# EAGLE design psvsd-v10 (EAGLE 8.2.2)

## Sheet 1 of 2: SD/USB
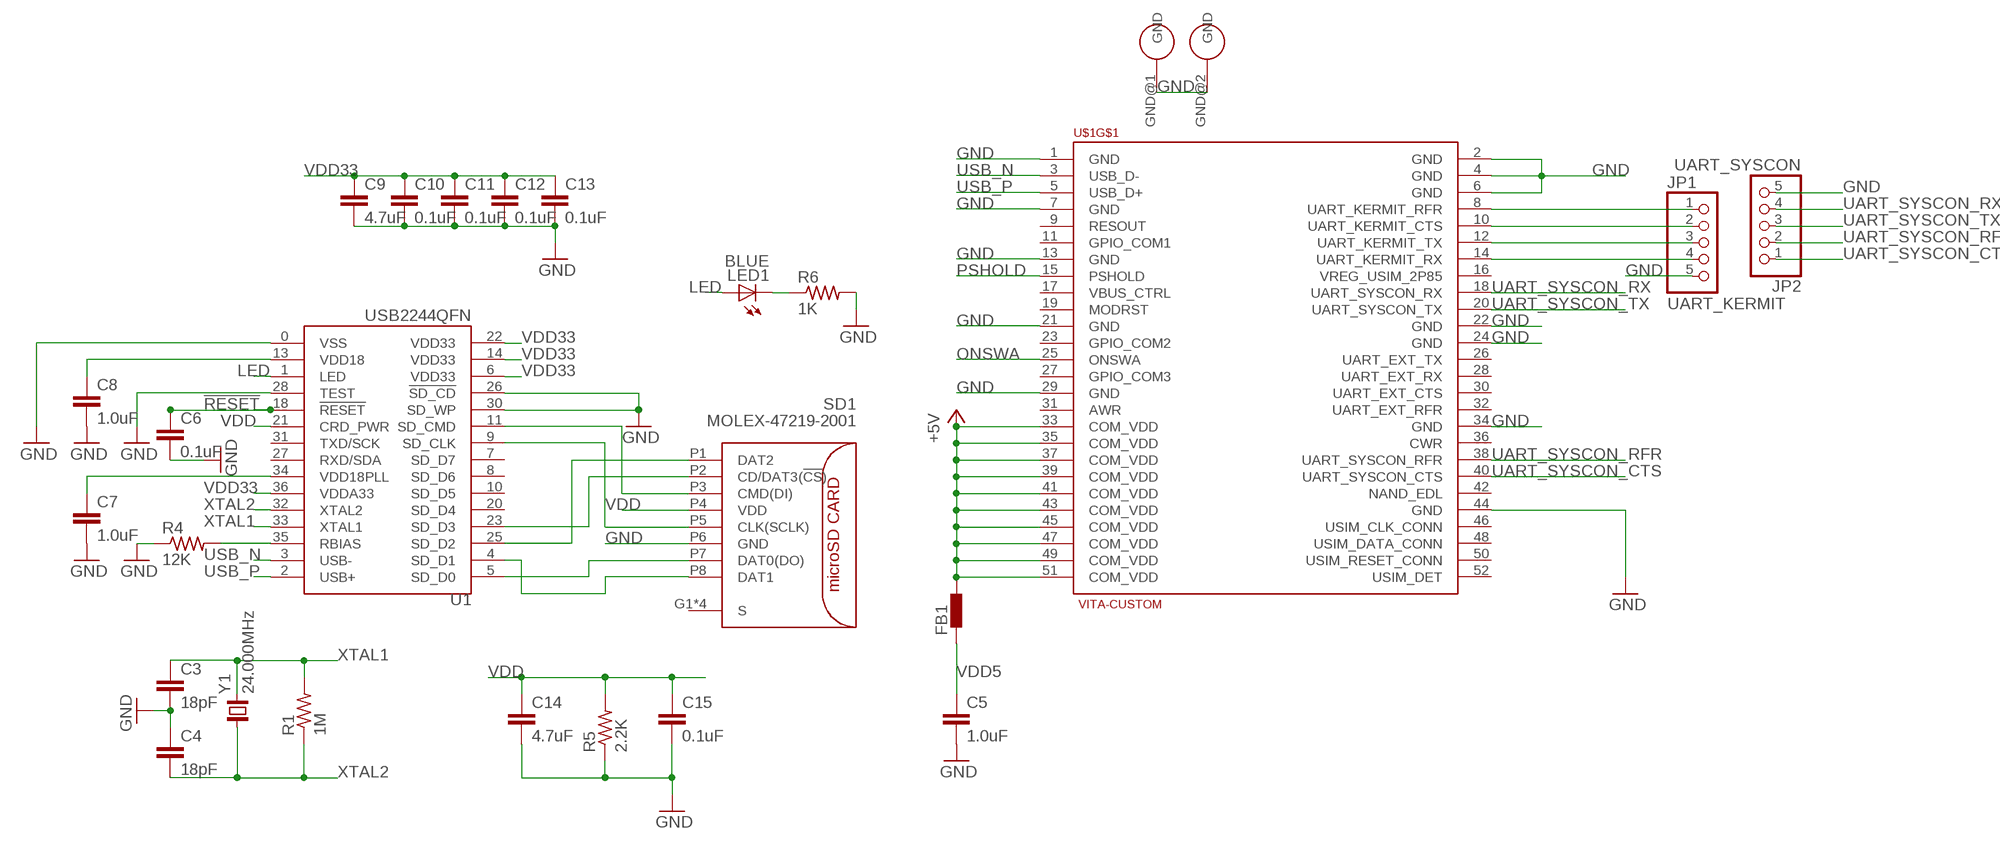
[diagram p0: schematic, sheet 1]

### Parts
C3  18pF  C-EUC0402  [C0402]
C4  18pF  C-EUC0402  [C0402]
C5  1.0uF  C-EUC0603  [C0603]
C6  0.1uF  C-EUC0402  [C0402]
C7  1.0uF  C-EUC0603  [C0603]
C8  1.0uF  C-EUC0603  [C0603]
C9  4.7uF  C-EUC0603  [C0603]
C10  0.1uF  C-EUC0402  [C0402]
C11  0.1uF  C-EUC0402  [C0402]
C12  0.1uF  C-EUC0402  [C0402]
C13  0.1uF  C-EUC0402  [C0402]
C14  4.7uF  C-EUC0603  [C0603]
C15  0.1uF  C-EUC0402  [C0402]
FB1  BLM15HB121SN1  [0402]
JP1  UART_KERMIT  PINHD-1X5  [1X05]
JP2  UART_SYSCON  PINHD-1X5  [1X05]
LED1  BLUE  LEDSML0603  [SML0603]
R1  1M  R-US_R0603  [R0603]
R4  12K  R-US_R0603  [R0603]
R5  2.2K  R-US_R0603  [R0603]
R6  1K  R-US_R0603  [R0603]
SD1  MOLEX-47219-2001  [MOLEX:47219-2001]
U1  USB2244QFN  [QFN36]
U$1  VITA-CUSTOM  [VITA-MINI-PCI-E]
Y1  24.000MHz  XRCGB  [XRCGB]

### Nets
!RESET: C6.1 U1.18(!RESET) ; also sheet 2
+5V: FB1.2 U$1.33(COM_VDD) U$1.35(COM_VDD) U$1.37(COM_VDD) U$1.39(COM_VDD) U$1.41(COM_VDD) U$1.43(COM_VDD) U$1.45(COM_VDD) U$1.47(COM_VDD) U$1.49(COM_VDD) U$1.51(COM_VDD)
GND: C3.2 C4.1 C5.2 C6.2 C7.2 C8.2 C9.2 C10.2 C11.2 C12.2 C13.2 C14.2 C15.2 JP1.5 JP2.5 R4.1 R5.1 R6.2 SD1.P6(GND) U1.0(VSS) U1.26(!SD_CD) U1.28(TEST) U1.30(SD_WP) U$1.1(GND) U$1.2(GND) U$1.4(GND) U$1.6(GND) U$1.7(GND) U$1.13(GND) U$1.21(GND) U$1.22(GND) U$1.24(GND) U$1.29(GND) U$1.34(GND) U$1.44(GND) U$1.GND@1(GND) U$1.GND@2(GND) ; also sheet 2
LED: LED1.A U1.1(LED)
N$1: LED1.C R6.1
ONSWA: U$1.25(ONSWA) ; also sheet 2
PSHOLD: U$1.15(PSHOLD) ; also sheet 2
RBIAS: R4.2 U1.35(RBIAS)
SD_CLK: SD1.P5(CLK(SCLK)) U1.9(SD_CLK)
SD_CMD: SD1.P3(CMD(DI)) U1.11(SD_CMD)
SD_D0: SD1.P7(DAT0(DO)) U1.5(SD_D0)
SD_D1: SD1.P8(DAT1) U1.4(SD_D1)
SD_D2: SD1.P1(DAT2) U1.25(SD_D2)
SD_D3: SD1.P2(CD/DAT3(!CS!)) U1.23(SD_D3)
UART_KERMIT_CTS: JP1.2 U$1.10(UART_KERMIT_CTS)
UART_KERMIT_RFR: JP1.1 U$1.8(UART_KERMIT_RFR)
UART_KERMIT_RX: JP1.4 U$1.14(UART_KERMIT_RX)
UART_KERMIT_TX: JP1.3 U$1.12(UART_KERMIT_TX)
UART_SYSCON_CTS: JP2.1 U$1.40(UART_SYSCON_CTS)
UART_SYSCON_RFR: JP2.2 U$1.38(UART_SYSCON_RFR)
UART_SYSCON_RX: JP2.4 U$1.18(UART_SYSCON_RX)
UART_SYSCON_TX: JP2.3 U$1.20(UART_SYSCON_TX)
USB_N: U1.3(USB-) U$1.3(USB_D-)
USB_P: U1.2(USB+) U$1.5(USB_D+)
USBVDD18: C8.1 U1.13(VDD18)
USBVDD18PLL: C7.1 U1.34(VDD18PLL)
VDD: C14.1 C15.1 R5.2 SD1.P4(VDD) U1.21(CRD_PWR)
VDD5: C5.1 FB1.1 ; also sheet 2
VDD33: C9.1 C10.1 C11.1 C12.1 C13.1 U1.6(VDD33) U1.14(VDD33) U1.22(VDD33) U1.36(VDDA33) ; also sheet 2
XTAL1: C3.1 R1.2 U1.33(XTAL1) Y1.3
XTAL2: C4.2 R1.1 U1.32(XTAL2) Y1.1
Unconnected: SD1.G1(S) SD1.G2(S) SD1.G3(S) SD1.G4(S) U1.7(SD_D7) U1.8(SD_D6) U1.10(SD_D5) U1.20(SD_D4) U1.27(RXD/SDA) U1.31(TXD/SCK) U$1.9(RESOUT) U$1.11(GPIO_COM1) U$1.16(VREG_USIM_2P85) U$1.17(VBUS_CTRL) U$1.19(MODRST) U$1.23(GPIO_COM2) U$1.26(UART_EXT_TX) U$1.27(GPIO_COM3) U$1.28(UART_EXT_RX) U$1.30(UART_EXT_CTS) U$1.31(AWR) U$1.32(UART_EXT_RFR) U$1.36(CWR) U$1.42(NAND_EDL) U$1.46(USIM_CLK_CONN) U$1.48(USIM_DATA_CONN) U$1.50(USIM_RESET_CONN) U$1.52(USIM_DET)

## Sheet 2 of 2: Power Management
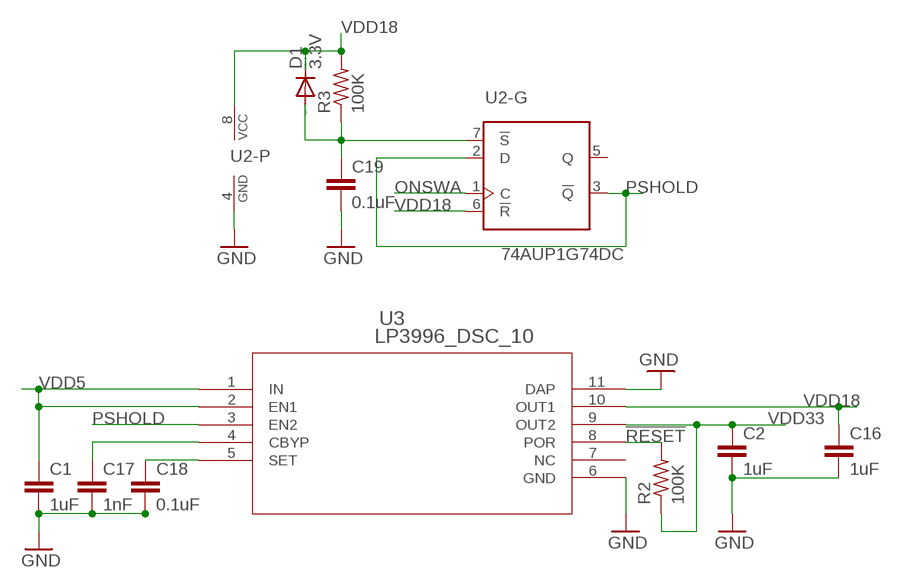
[diagram p1: schematic, sheet 2]

### Parts
C1  1uF  C-EUC0603  [C0603]
C2  1uF  C-EUC0603  [C0603]
C16  1uF  C-EUC0603  [C0603]
C17  1nF  C-EUC0402  [C0402]
C18  0.1uF  C-EUC0402  [C0402]
C19  0.1uF  C-EUC0402  [C0402]
D1  3.3V  DIODE-SOD523  [SOD523]
R2  100K  R-US_R0603  [R0603]
R3  100K  R-US_R0603  [R0603]
U2  74AUP1G74DC  [SOT765]
U3  LP3996_DSC_10  [SDA10A]

### Nets
!RESET: R2.2 U3.8(POR) ; also sheet 1
!S: C19.1 D1.A R3.1 U2.7(-G:!S)
CBYP: C17.1 U3.4(CBYP)
CSET: C18.1 U3.5(SET)
GND: C1.2 C2.2 C16.2 C17.2 C18.2 C19.2 U2.4(-P:GND) U3.6(GND) U3.11(DAP) ; also sheet 1
ONSWA: U2.1(-G:C) ; also sheet 1
PSHOLD: U2.2(-G:D) U2.3(-G:!Q) U3.3(EN2) ; also sheet 1
VDD5: C1.1 U3.1(IN) U3.2(EN1) ; also sheet 1
VDD18: C16.1 D1.C R3.2 U2.6(-G:!R) U2.8(-P:VCC) U3.10(OUT1)
VDD33: C2.1 R2.1 U3.9(OUT2) ; also sheet 1
Unconnected: U2.5(-G:Q) U3.7(NC)

## Library data of the parts
C1-C17 C19 = rcl:C-EU: CAPACITOR, European symbol
C18 = resistor:C-EU: CAPACITOR, European symbol
D1 = diode:DIODE-: DIODE
FB1 = inductors:BLM15H: EMIFIL (R) Chip Ferrite Bead for GHz Noise Source: http://www.murata.com/ Ferrite Bead BLM15H.pdf
JP1 JP2 = pinhead:PINHD-1X5: PIN HEADER
LED1 = led:LED: LED OSRAM: - CHIPLED LG R971, LG N971, LY N971, LG Q971, LY Q971, LO R971, LY R971 LH N974, LH R974 LS Q976, LO Q976, LY Q976 LO Q996 - Hyper CHIPLED LW Q18S LB Q993, LB Q99A, LB R99A - SideLED LS A670, LO A670, LY A670, LG A670, LP A670 LB A673, LV A673, LT A673, LW A673 LH A674 LY A675 LS A676, LA A676, LO A676, LY A676, LW A676 LS A679, LY A679, LG A679 - Hyper Micro SIDELED® LS Y876, LA Y876, LO Y876, LY Y876 LT Y87S - SmartLED LW L88C, LW L88S LB L89C, LB L89S, LG L890 LS L89K, LO L89K, LY L89K LS L896, LA L896, LO L896, LY L896 - TOPLED LS T670, LO T670, LY T670, LG T670, LP T670 LSG T670, LSP T670, LSY T670, LOP T670, LYG T670 LG T671, LOG T671, LSG T671 LB T673, LV T673, LT T673, LW T673 LH T674 LS T676, LA T676, LO T676, LY T676, LB T676, LH T676, LSB T676, LW T676 LB T67C, LV T67C, LT T67C, LS T67K, LO T67K, LY T67K, LW E67C LS E67B, LA E67B, LO E67B, LY E67B, LB E67C, LV E67C, LT E67C LW T67C LS T679, LY T679, LG T679 LS T770, LO T770, LY T770, LG T770, LP T770 LB T773, LV T773, LT T773, LW T773 LH T774 LS E675, LA E675, LY E675, LS T675 LS T776, LA T776, LO T776, LY T776, LB T776 LHGB T686 LT T68C, LB T68C - Hyper Mini TOPLED® LB M676 - Mini TOPLED Santana® LG M470 LS M47K, LO M47K, LY M47K Source: http://www.osram.convergy.de LUXEON: - LUMILED® LXK2-PW12-R00, LXK2-PW12-S00, LXK2-PW14-U00, LXK2-PW14-V00 LXK2-PM12-R00, LXK2-PM12-S00, LXK2-PM14-U00 LXK2-PE12-Q00, LXK2-PE12-R00, LXK2-PE12-S00, LXK2-PE14-T00, LXK2-PE14-U00 LXK2-PB12-K00, LXK2-PB12-L00, LXK2-PB12-M00, LXK2-PB14-N00, LXK2-PB14-P00, LXK2-PB14-Q00 LXK2-PR12-L00, LXK2-PR12-M00, LXK2-PR14-Q00, LXK2-PR14-R00 LXK2-PD12-Q00, LXK2-PD12-R00, LXK2-PD12-S00 LXK2-PH12-R00, LXK2-PH12-S00 LXK2-PL12-P00, LXK2-PL12-Q00, LXK2-PL12-R00 Source: www.luxeon.com KINGBRIGHT: KA-3528ASYC Source: www.kingbright.com
R1-R6 = rcl:R-US_: RESISTOR, American symbol
SD1 = molex:MOLEX-47219-2001
U1 = USB2244:USB2244: USB2244/USB2244I
U2 = NXP_60_26022015:74AUP1G74: Low-power D-type flip-flop with set and reset; positive-edge trigger The 74AUP1G74 provides a low-power, low-voltage single positive-edge triggered D-type flip-flop with individual data (D), clock (CP), set (SD) and reset (RD) inputs and complementary Q and Q outputs. The SD and RD are asynchronous active LOW inputs and operate independently of the clock input. Information on the data input is transferred to the Q output on the LOW-to-HIGH transition of the clock pulse. The D input must be stable one set-up time prior to the LOW-to-HIGH clock transition for predictable operation. Schmitt trigger action at all inputs makes the circuit tolerant to slower input rise and fall times across the entire VCC range from 0.8 V to 3.6 V. This device ensures a very low static and dynamic power consumption across the entire VCC range from 0.8 V to 3.6 V. This device is fully specified for partial power-down applications using IOFF. The IOFF circuitry disables the output, preventing the damaging backflow current through the device when it is powered down. AAL Eindhoven MK
U3 = LP3996:LP3996_DSC_10; BASE_PN: LP3996; COMP: TypeLDO; LIBRARY: ReferenceLP3996SD; PARTNUMBER: LP3996SD0833; PIN: Count10; SYMBOL: NameLP3996SD0833; TYPE: LP3996SD0833; VENDOR: NationalSemiconductor; VERSION: 1
U$1 = mini-pci-e:VITA-CUSTOM: Vita specific half Mini PCI Express module.
Y1 = crystal:XRCGB: CRYSTAL

## Board
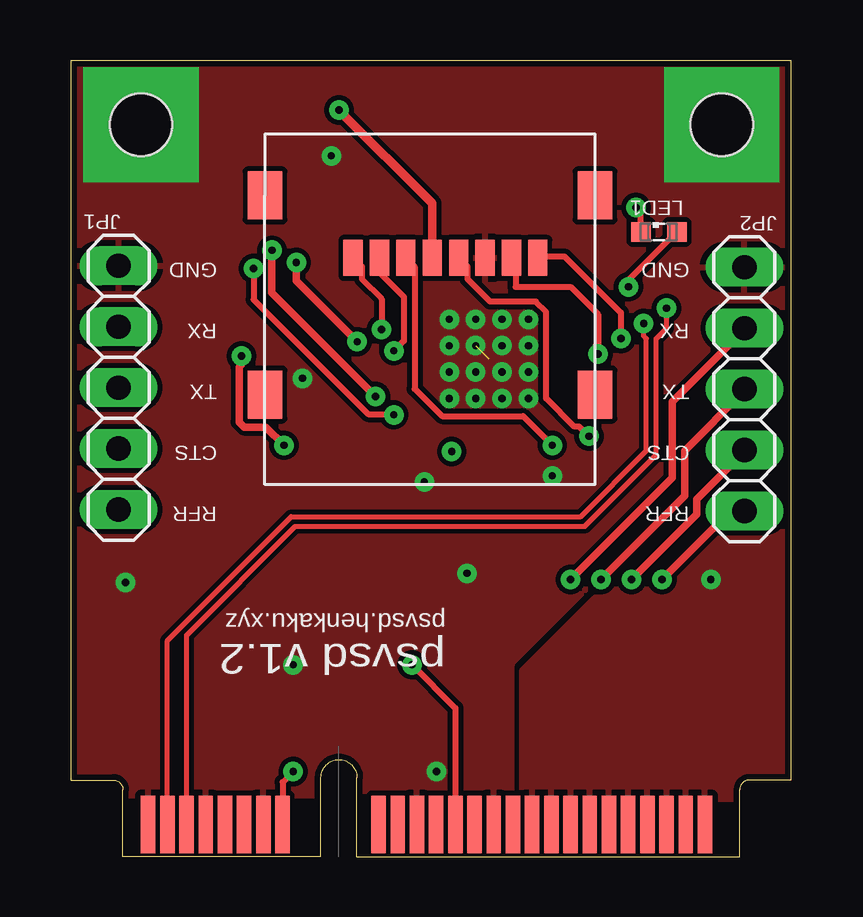
[diagram p2: board, top side]
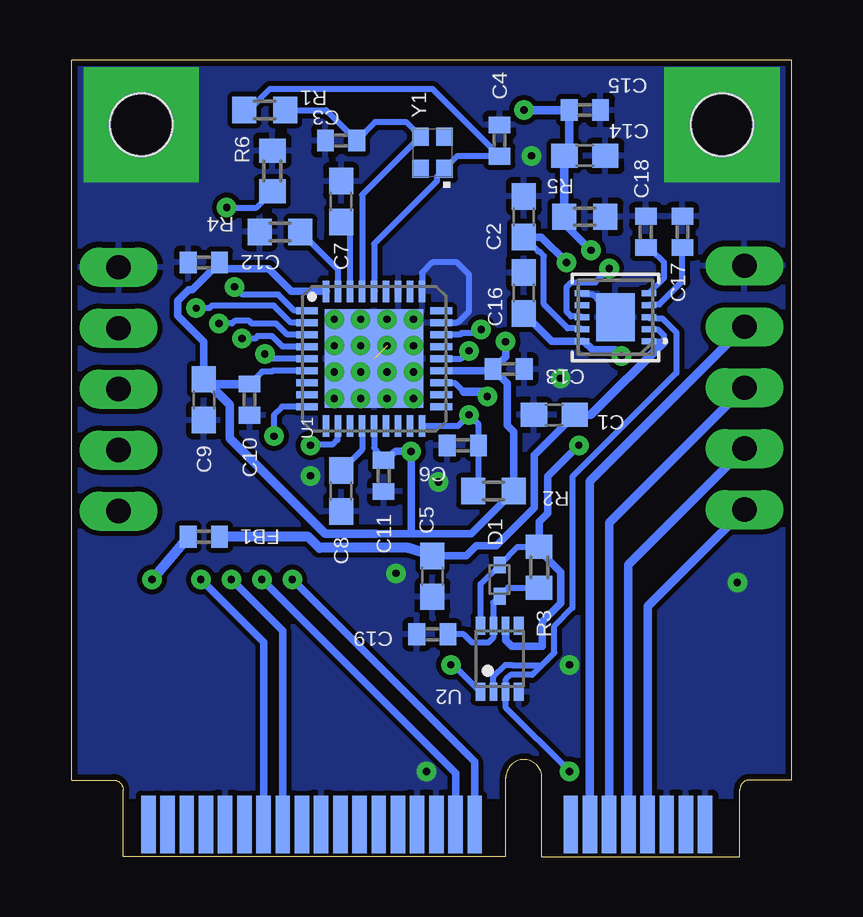
[diagram p3: board, bottom side, seen from below]

Size 30 x 33.2 mm. Coordinates in mm from the lower left corner, seen from the top.
Copper layers (1*16): Top 0.035mm / dielectric 1.5mm / Bottom 0.035mm
Design rules "SparkFun *": minimum track width 8mil, minimum drill 12mil, track to track 8mil, track to pad 8mil, pad to pad 8mil, via to via 8mil, smd to smd 8mil, copper to edge 10mil, drill to drill 8mil, minimum pad ring 12mil, minimum via ring 10mil, stop-mask expansion 4mil, vias tented up to drill 25mil, thermal gap 10mil

### Footprints (pad centres in the part's own frame; a part is rotated, then mirrored left to right if it is on the bottom)
C0603 = smd 1.1 x 1: 1 -0.85,0; 2 0.85,0
C0402 = smd 0.7 x 0.9: 1 -0.65,0; 2 0.65,0
SOD523 = smd 0.7 x 0.5: A 0.7,0; C -0.6,0
0402 = smd 0.7 x 0.9: 1 -0.65,0; 2 0.65,0
1X05 = drill 1.016 long: 1 -5.08,0; 2 -2.54,0; 3 0,0; 4 2.54,0; 5 5.08,0
SML0603 = smd 0.8 x 0.8: A 0.75,0; C -0.75,0
R0603 = smd 1 x 1.1: 1 -0.85,0; 2 0.85,0
MOLEX:47219-2001 = smd 1.45 x 2: G1 13.75,0; G2 13.75,8.3; G3 0,8.3; G4 0,0 | smd 0.8 x 1.5: P1 10.08,2.6; P2 8.98,2.6; P3 7.88,2.6; P4 6.78,2.6; P5 5.68,2.6; P6 4.58,2.6; P7 3.48,2.6; P8 2.38,2.6
QFN36 = smd 4.1 x 4.1: 0 0,0 | smd 0.28 x 0.9: 1 -2,-2.8; 2 -1.5,-2.8; 3 -1,-2.8; 4 -0.5,-2.8; 5 0,-2.8; 6 0.5,-2.8; 7 1,-2.8; 8 1.5,-2.8; 9 2,-2.8; 19 2,2.8; 20 1.5,2.8; 21 1,2.8; 22 0.5,2.8; 23 0,2.8; 24 -0.5,2.8; 25 -1,2.8; 26 -1.5,2.8; 27 -2,2.8 | smd 0.9 x 0.28: 10 2.8,-2; 11 2.8,-1.5; 12 2.8,-1; 13 2.8,-0.5; 14 2.8,0; 15 2.8,0.5; 16 2.8,1; 17 2.8,1.5; 18 2.8,2; 28 -2.8,2; 29 -2.8,1.5; 30 -2.8,1; 31 -2.8,0.5; 32 -2.8,0; 33 -2.8,-0.5; 34 -2.8,-1; 35 -2.8,-1.5; 36 -2.8,-2
SOT765 = smd 0.4 x 0.75: 1 -0.8,-1.375; 4 0.8,-1.375; 5 0.8,1.375; 8 -0.8,1.375 | smd 0.3 x 0.75: 2 -0.25,-1.375; 3 0.25,-1.375; 6 0.25,1.375; 7 -0.25,1.375
SDA10A = smd 0.61 x 0.254: 1 -1.397,1; 2 -1.397,0.5; 3 -1.397,0; 4 -1.397,-0.5; 5 -1.397,-1; 6 1.397,-1; 7 1.397,-0.5; 8 1.397,0; 9 1.397,0.5; 10 1.397,1 | smd 1.6 x 2.007: 11 0,0
VITA-MINI-PCI-E = smd 0.6 x 2.4: 1 -7.95,1.35; 3 -7.15,1.35; 5 -6.35,1.35; 7 -5.55,1.35; 9 -4.75,1.35; 11 -3.95,1.35; 13 -3.15,1.35; 15 -2.35,1.35; 17 1.65,1.35; 19 2.45,1.35; 21 3.25,1.35; 23 4.05,1.35; 25 4.85,1.35; 27 5.65,1.35; 29 6.45,1.35; 31 7.25,1.35; 33 8.05,1.35; 35 8.85,1.35; 37 9.65,1.35; 39 10.45,1.35; 41 11.25,1.35; 43 12.05,1.35; 45 12.85,1.35; 47 13.65,1.35; 49 14.45,1.35; 51 15.25,1.35 | smd 0.6 x 2.4 bottom: 2 -7.55,1.35; 4 -6.75,1.35; 6 -5.95,1.35; 8 -5.15,1.35; 10 -4.35,1.35; 12 -3.55,1.35; 14 -2.75,1.35; 16 -1.95,1.35; 18 2.05,1.35; 20 2.85,1.35; 22 3.65,1.35; 24 4.45,1.35; 26 5.25,1.35; 28 6.05,1.35; 30 6.85,1.35; 32 7.65,1.35; 34 8.45,1.35; 36 9.25,1.35; 38 10.05,1.35; 40 10.85,1.35; 42 11.65,1.35; 44 12.45,1.35; 46 13.25,1.35; 48 14.05,1.35; 50 14.85,1.35; 52 15.65,1.35 | drill 2.6 pad 4.8 square: GND@1 -8.25,30.5; GND@2 15.95,30.5 | hole 2.6: -8.25,30.5; 15.95,30.5
XRCGB = smd 0.75 x 0.7: 1 -0.675,-0.5; 2 0.675,-0.5; 3 0.675,0.5; 4 -0.675,0.5

### Placement (x,y rotation side)
C1  9.88,18.41 180 bottom
C2  11.15,26.67 90 bottom
C3  18.77,29.84 180 bottom
C4  12.17,29.84 270 bottom
C5  14.96,11.68 270 bottom
C6  13.69,17.14 180 bottom
C7  18.77,27.3 90 bottom
C8  18.77,15.24 270 bottom
C9  24.48,19.05 270 bottom
C10  22.58,19.05 270 bottom
C11  16.99,15.88 270 bottom
C12  24.48,24.77 180 bottom
C13  11.79,20.32 0 bottom
C14  8.61,29.21 0 bottom
C15  8.61,31.12 0 bottom
C16  11.15,23.49 90 bottom
C17  4.55,26.04 90 bottom
C18  6.07,26.04 90 bottom
C19  14.96,9.27 180 bottom
D1  12.17,11.56 270 bottom
FB1  24.48,13.34 180 bottom
JP1  1.97,19.54 90 top
JP2  28.04,19.48 90 top
LED1  24.48,26.04 0 top
R1  21.95,31.12 0 bottom
R2  12.42,15.24 180 bottom
R3  10.52,12.07 90 bottom
R4  21.31,26.04 0 bottom
R5  8.61,26.67 180 bottom
R6  21.63,28.57 90 bottom
SD1  21.82,27.56 180 top
U1  17.39,20.75 270 bottom
U2  12.17,8.26 0 bottom
U3  7.34,22.48 180 bottom
U$1  11.15,0 0 top
Y1  14.96,29.34 90 bottom

### Tracks (layer width: path | path; a pad name or v marks a point on that pad's centre or on a via)
!RESET  (via drill 0.3)
  Top 0.254: v13.44,18.41 13.41,18.44 12.37,18.44 7.59,23.21 v7.59,24.51
  Bottom 0.254: R2.2 13.04,15.24 C6.1 13.04,18.02 v13.44,18.41 13.9,17.95 U1.18 | U3.8 8.78,22.52 9.18,22.52 9.37,22.71 9.37,23.74 9.18,23.94 8.17,23.94 v7.59,24.51
!S
  Bottom 0.254: U2.7 12.44,9.61 12.44,9.48 | 12.44,9.48 12.44,9.12 12.63,8.93 13.3,8.93 13.65,9.27 C19.1 | 12.44,9.48 12.44,10.59 D1.A 11.81,11.21 R3.1
+5V  (via drill 0.3)
  Top 0.406: U$1.35 20.04,1.39 | 26.39,1.36 U$1.51
  Bottom 0.406: FB1.2 v26.64,11.56
  pour Top: 18.77,2.41 29.95,2.41 29.95,13.84 24.87,13.84 18.77,7.75
CBYP
  Bottom 0.254: U3.4 5.9,23.02 5.5,23.02 4.55,23.98 C17.1
CSET
  Bottom 0.254: C18.1 6.07,25.27 5.82,25.27 5.31,24.77 5.31,24.11 U3.5
GND  (via drill 0.3)  (1 unrouted)
  Top 0.254: 5.77,1.52 U$1.7
  Bottom 0.254: U3.6 8.69,23.44 8.3,23.44 8.1,23.24 U3.11 | U1.26 13.95,22.25 13.93,22.28 13.89,22.28 13.44,22.73 13.44,24.26 13.94,24.77 14.96,24.77 15.39,24.33 U1.28
  other vias: 10.83,29.21 2.26,11.43 15.75,22.39 16.85,22.39 17.95,22.39 19.05,22.39 15.75,21.29 16.85,21.29 17.95,21.29 19.05,21.29 15.75,20.2 16.85,20.2 17.95,20.2 19.05,20.2 15.75,19.09 16.85,19.09 17.95,19.09 19.05,19.09 9.25,8 14.71,15.62 9.63,19.94 20.04,15.88 16.48,11.81 15.21,3.56
  pour Top (rank 2): -0.28,33.66 30.2,33.66 30.2,2.54 -0.28,2.54
  pour Bottom (rank 2): -0.28,33.66 30.2,33.66 30.2,2.54 -0.28,2.54
LED  (via drill 0.3)
  Top 0.254: v23.22,23.75 23.22,24.02 LED1.A
  Bottom 0.254: U1.1 20.72,22.75 21.38,23.42 22.88,23.42 v23.22,23.75
N$1  (via drill 0.3)
  Top 0.254: LED1.C 23.73,26.85 v23.53,27.05
  Bottom 0.254: v23.53,27.05 22.3,27.05 R6.1
ONSWA  (via drill 0.3)
  Top 0.254: v14.2,8 16,6.2 U$1.25
  Bottom 0.254: U2.1 14.09,8 v14.2,8
PSHOLD  (via drill 0.3)
  Top 0.254: v9.25,3.56 8.8,3.11 U$1.15
  Bottom 0.254: U2.3 | U3.3 5.9,22.44 5.38,22.44 4.8,21.86 4.8,20.17 9.13,15.84 9.13,10.37 9.88,9.62 9.88,8.51 10.4,7.99 | 10.4,7.99 10.8,7.58 11.7,7.58 11.9,7.39 11.9,6.9 | 11.9,6.9 U2.3 | U2.2 12.42,7.49 11.91,8 11.66,8 11.65,7.99 10.4,7.99 | 11.9,6.86 U2.3 | 9.37,3.84 v9.25,3.56 11.9,6.21 11.9,6.9
RBIAS
  Bottom 0.254: U1.35 18.89,24.47 R4.2
SD_CLK  (via drill 0.3)
  Top 0.254: 16.23,24.87 SD1.P5 16.51,24.59 16.51,24.07 17.45,23.13 19.36,23.13 19.79,22.7 19.79,19.1 20.96,17.93 21.16,17.93 v21.56,17.53
  Bottom 0.254: U1.9 21.22,18.75 21.56,18.41 v21.56,17.53
SD_CMD  (via drill 0.3)
  Top 0.254: SD1.P3 14.31,24.59 14.31,19.49 15.45,18.36 18.83,18.36 v20.04,17.14
  Bottom 0.254: U1.11 18.92,17.92 18.92,17.37 19.12,17.17 20.01,17.17 v20.04,17.14
SD_D0  (via drill 0.3)
  Top 0.254: 21.84,21.29 21.95,21.18 v21.95,20.95 21.95,22.61 20.8,23.75 18.52,23.75 18.52,24.78 SD1.P7
  Bottom 0.254: U1.5 21.75,20.75 v21.95,20.95
SD_D1  (via drill 0.3)
  Top 0.254: SD1.P8 19.5,25.02 20.55,25.02 22.9,22.67 v22.9,21.59
  Bottom 0.254: U1.4 21.2,21.25 21.64,21.69 22.25,21.69 22.35,21.59 v22.9,21.59
SD_D2  (via drill 0.3)
  Top 0.254: SD1.P1 12.11,24.59 12.11,24.07 12.93,23.25 v12.93,21.97
  Bottom 0.254: U1.25 13.81,21.75 13.74,21.82 13.08,21.82 v12.93,21.97
SD_D3  (via drill 0.3)
  Top 0.254: SD1.P2 12.84,24.35 13.85,23.33 13.85,21.5 v13.44,21.08
  Bottom 0.254: U1.23 13.76,20.75 v13.44,21.08
UART_KERMIT_CTS
  Bottom 0.356: U$1.10 6.8,12.17 JP1.2
UART_KERMIT_RFR
  Bottom 0.356: U$1.8 6,10.43 JP1.1
UART_KERMIT_RX
  Bottom 0.356: U$1.14 8.4,15.65 JP1.4
UART_KERMIT_TX
  Bottom 0.356: U$1.12 7.6,13.91 JP1.3
UART_SYSCON_CTS  (via drill 0.3)
  Top 0.305: v24.61,11.56 27.46,14.4 JP2.1
  Bottom 0.305: v24.61,11.56 22,8.95 U$1.40
UART_SYSCON_RFR  (via drill 0.3)
  Top 0.305: v23.34,11.56 26.06,14.28 26.06,14.89 28.04,16.87 JP2.2
  Bottom 0.305: v23.34,11.56 21.2,9.42 U$1.38
UART_SYSCON_RX  (via drill 0.3)
  Top 0.305: v20.8,11.56 25.04,15.8 25.04,18.95 28.04,21.95 JP2.4
  Bottom 0.305: 13.34,1.49 U$1.18 13.2,3.96 v20.8,11.56
UART_SYSCON_TX  (via drill 0.3)
  Top 0.305: v22.07,11.56 25.55,15.04 25.55,16.92 28.04,19.41 JP2.3
  Bottom 0.305: 14.14,1.49 U$1.20 14,3.48 v22.07,11.56
USB_N  (via drill 0.3)
  Top 0.203: U$1.3 4,9.01 9.16,14.17 21.23,14.17 23.96,16.91 23.96,21.59 23.85,21.7 v23.85,22.22
  Top 0.254: v23.85,22.22 23.94,22.14
  Bottom 0.254: U1.3 21.01,21.75 21.48,22.22 22.48,22.22 22.59,22.33 23.2,22.33 23.3,22.22 v23.85,22.22
USB_P  (via drill 0.3)
  Top 0.203: U$1.5 4.8,9.24 9.33,13.77 21.39,13.77 24.37,16.74 24.37,21.59 24.8,22.02 v24.8,22.86
  Top 0.254: 24.59,22.64 v24.8,22.86
  Bottom 0.254: v24.8,22.86 24.26,22.86 24.16,22.96 21.57,22.96 20.86,22.25 U1.2
USBVDD18
  Bottom 0.254: U1.13 17.89,16.97 C8.1
USBVDD18PLL
  Bottom 0.254: U1.34 18.39,26.08 C7.1
VDD  (via drill 0.3)
  Top 0.305: v8.36,25.27 8.36,23.49 v12.67,19.18
  Top 0.356: 11.31,31.12 v11.15,31.12 15.04,27.23 SD1.P4
  Bottom 0.254: 13.37,19.37 13.65,19.37 14.01,19.72 14.56,19.72 U1.21
  Bottom 0.305: R5.2 9.46,26.38 v8.36,25.27
  Bottom 0.356: v11.15,31.12 C15.1 9.26,29.41 C14.1 R5.2 9.35,26.67 | v12.67,19.18 12.87,19.37 13.65,19.37
VDD5
  Bottom 0.254: U3.2 5.57,21.98 5.31,21.72 5.31,21.46 5.93,21.46 U3.1
  Bottom 0.305: C1.1 10.71,16.73 10.71,14.54 12.31,12.95 13.14,12.95 13.56,12.53 C5.1
  Bottom 0.356: C1.1 8.36,18.41 5.31,21.46
  Bottom 0.406: FB1.1 20.13,13.34 19.67,12.88 15.99,12.88 C5.1
VDD18  (via drill 0.3)
  Top 0.305: v7.09,20.87 7.09,20.5 6.99,20.41 6.99,18.11 7.2,17.9 8.11,17.9 v8.86,17.14
  Bottom 0.254: R3.2 11.41,12.92 D1.C 12.97,11.36 U2.8
  Bottom 0.305: C16.1 9.98,21.48 U3.10 8.65,21.48 8.29,21.12 7.34,21.12 v7.09,20.87 | v8.86,17.14 10.16,15.85 10.16,14.31 10.52,13.95 R3.2 10.52,12.77 9.61,11.86 9.61,10.57 10.39,9.79 10.39,8.76 11.66,8.76 11.91,9.02 U2.6
VDD33  (via drill 0.3)
  Top 0.305: v9.37,24.77 9.37,24 v11.91,21.46
  Bottom 0.254: U1.14 17.39,17.05 C11.1 | U1.6 21.6,20.25 21.64,20.22 22.06,20.22 C10.1 | U3.9 8.78,22.02 9.33,22.02 10.32,23.02 10.32,25.03 10.51,25.22 10.56,25.22 C2.1
  Bottom 0.305: 12.5,20.25 U1.22 | 17.5,13.46 15.85,13.46 | 15.85,13.46 v15.85,16.89 16.5,16.89 C11.1 | U1.36 20.84,23.55 21.79,24.51 23.58,24.51 C12.1 24.43,24.17 24.98,23.62 25.12,23.62 25.56,23.18 25.56,22.54 24.48,21.46 C9.1 | 15.85,13.46 13.35,13.46 R2.1 11.57,17.7 11.84,17.97 11.84,19.73 C13.1 | 12.34,20.41 C13.1 | C13.1 11.91,20.84 v11.91,21.46 | v9.37,24.77 10.43,25.82 C2.1
  Bottom 0.356: 12.5,20.25 C13.1 | C10.1 24.29,19.7 C9.1 23.41,18.83 23.41,17.44 19.43,13.46 17.5,13.46 17.29,13.46
XTAL1
  Bottom 0.254: U1.33 17.89,27.58 Y1.3 16.05,30.61 17.36,30.61 C3.1 19.39,31.12 R1.2
XTAL2
  Bottom 0.254: 17.36,23.58 U1.32 17.39,25.54 14.78,28.15 14.78,28.34 Y1.1 13.93,29.2 C4.2 14.97,31.99 21.73,31.99 22.61,31.12 R1.1

### Text on the board
tPlace: GND | GND | RX | RX | TX | TX | CTS | CTS | RFR | RFR | psvsd.henkaku.xyz | psvsd v1.2